# Altium schematic sheet ADS.SchDoc
size A4
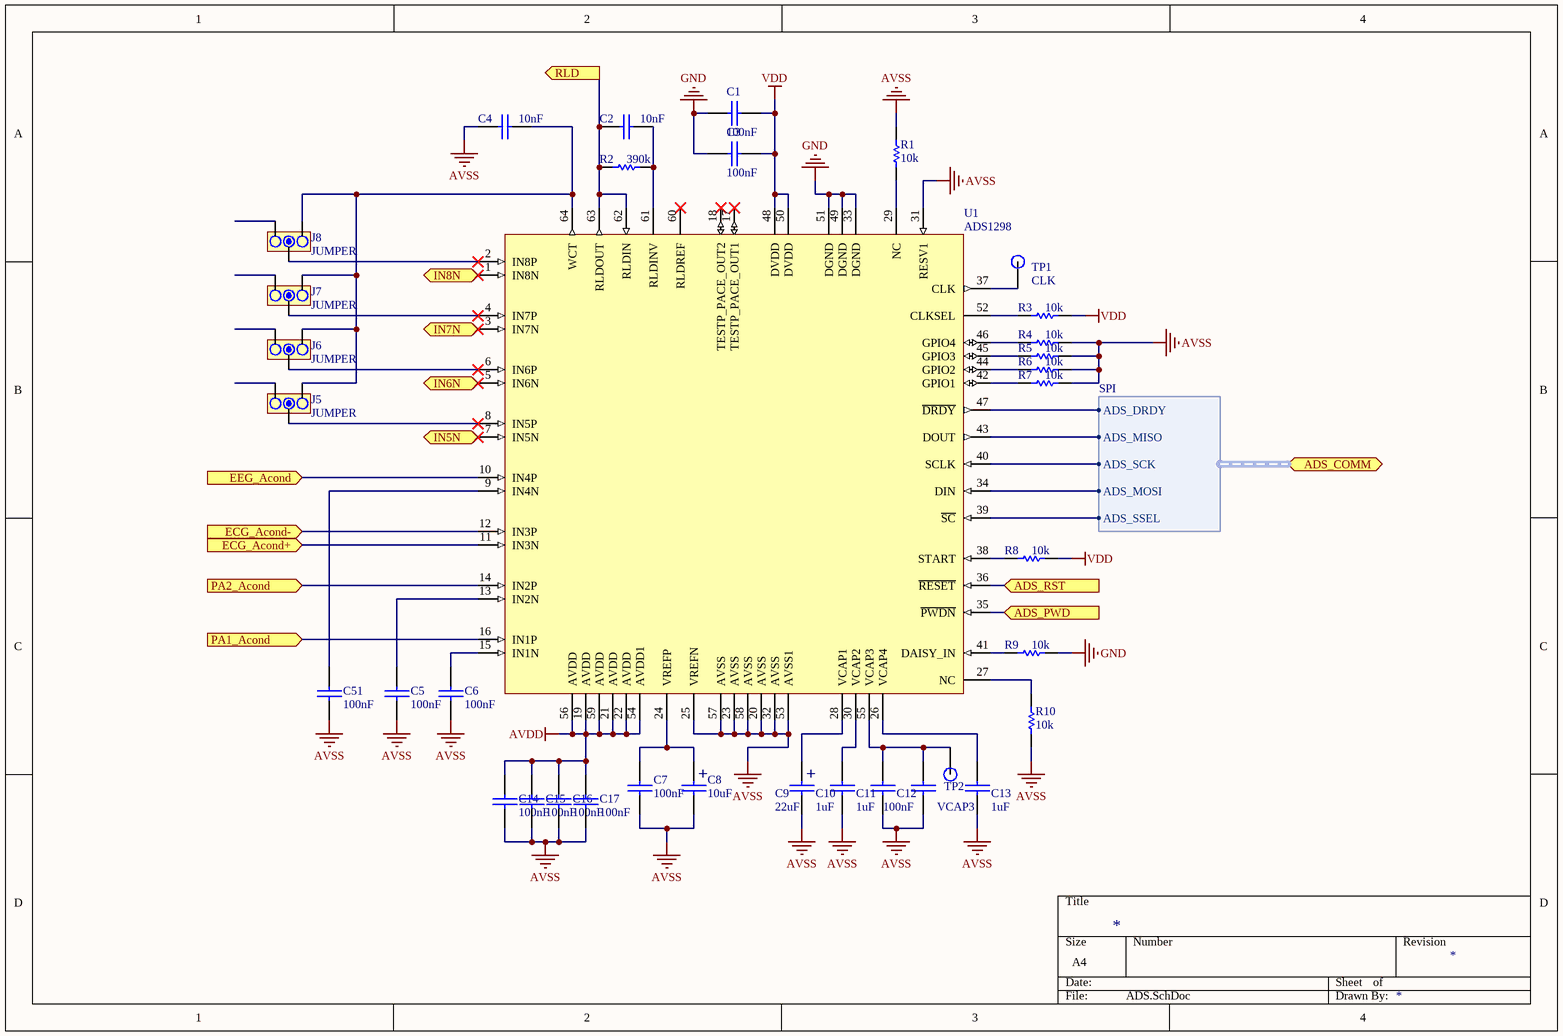
[diagram p0: ADS.SchDoc]

## Parts
C1  value 100nF  [0805]  (hidden comment: Capacitor)
C2  value 10nF  [0805]  (hidden comment: Capacitor)
C3  value 100nF  [0805]  (hidden comment: Capacitor)
C4  value 10nF  [0805]  (hidden comment: Capacitor)
C5  value 100nF  [0805]  (hidden comment: Capacitor)
C6  value 100nF  [0805]  (hidden comment: Capacitor)
C7  value 100nF  [0805]  (hidden comment: Capacitor)
C8  value 10uF  [1211 (3528)]  (hidden comment: CAPPOL)
C9  value 22uF  [1211 (3528)]  (hidden comment: CAPPOL)
C10  value 1uF  [0805]  (hidden comment: Capacitor)
C11  value 1uF  [0805]  (hidden comment: Capacitor)
C12  value 100nF  [0805]  (hidden comment: Capacitor)
C13  value 1uF  [0805]  (hidden comment: Capacitor)
C14  value 100nF  [0805]  (hidden comment: Capacitor)
C15  value 100nF  [0805]  (hidden comment: Capacitor)
C16  value 100nF  [0805]  (hidden comment: Capacitor)
C17  value 100nF  [0805]  (hidden comment: Capacitor)
C51  value 100nF  [0805]  (hidden comment: Capacitor)
J5  JUMPER  [JUMPER3]
J6  JUMPER  [JUMPER3]
J7  JUMPER  [JUMPER3]
J8  JUMPER  [JUMPER3]
R1  value 10k  [0805]  (hidden comment: Resistor)
R2  value 390k  [0805]  (hidden comment: Resistor)
R3  value 10k  [0805]  (hidden comment: Resistor)
R4  value 10k  [0805]  (hidden comment: Resistor)
R5  value 10k  [0805]  (hidden comment: Resistor)
R6  value 10k  [0805]  (hidden comment: Resistor)
R7  value 10k  [0805]  (hidden comment: Resistor)
R8  value 10k  [0805]  (hidden comment: Resistor)
R9  value 10k  [0805]  (hidden comment: Resistor)
R10  value 10k  [0805]  (hidden comment: Resistor)
TP1  CLK  [PAD]
TP2  VCAP3  [PAD]
U1  ADS1298  [PAG64]

## Ports
ADS_COMM (harness SPI), ADS_PWD (in), ADS_RST (in), ECG_Acond+ (in), ECG_Acond- (in), EEG_Acond (in), IN5N (in), IN6N (in), IN7N (in), IN8N (in), PA1_Acond (in), PA2_Acond (in), RLD (out)

## Harnesses
SPI: ADS_DRDY, ADS_MISO, ADS_SCK, ADS_MOSI, ADS_SSEL

## Nets
AVDD: C14.1 C15.1 C16.1 C17.1 U1.19(AVDD) U1.21(AVDD) U1.22(AVDD) U1.54(AVDD1) U1.56(AVDD) U1.59(AVDD)
AVSS: C4.2 C5.1 C6.1 C7.1 C8.2 C9.2 C10.1 C11.1 C12.1 C13.1 C14.2 C15.2 C16.2 C17.2 C51.1 R1.1 R4.2 R5.2 R6.2 R7.2 R10.1 U1.20(AVSS) U1.23(AVSS) U1.25(VREFN) U1.31(RESV1) U1.32(AVSS) U1.53(AVSS1) U1.57(AVSS) U1.58(AVSS)
GND: C1.2 C3.2 R9.2 U1.33(DGND) U1.49(DGND) U1.51(DGND)
VDD: C1.1 C3.1 R3.2 R8.2 U1.48(DVDD) U1.50(DVDD)
ADS_PWD: U1.35(~{PWDN}) ; port ADS_PWD
ADS_RST: U1.36(~{RESET}) ; port ADS_RST
ECG_Acond+: U1.11(IN3N) ; port ECG_Acond+
ECG_Acond-: U1.12(IN3P) ; port ECG_Acond-
EEG_Acond: U1.10(IN4P) ; port EEG_Acond
IN5N: U1.7(IN5N) ; port IN5N
IN6N: U1.5(IN6N) ; port IN6N
IN7N: U1.3(IN7N) ; port IN7N
IN8N: U1.1(IN8N) ; port IN8N
PA1_Acond: U1.16(IN1P) ; port PA1_Acond
PA2_Acond: U1.14(IN2P) ; port PA2_Acond
RLD: C2.2 R2.1 U1.62(RLDIN) U1.63(RLDOUT) ; port RLD
NetC2_1: C2.1 R2.2 U1.61(RLDINV)
NetC4_1: C4.1 J5.3 J6.3 J7.3 J8.3 U1.64(WCT)
NetC5_2: C5.2 U1.13(IN2N)
NetC6_2: C6.2 U1.15(IN1N)
NetC7_2: C7.2 C8.1 U1.24(VREFP)
NetC9_1: C9.1 U1.28(VCAP1)
NetC10_2: C10.2 U1.30(VCAP2)
NetC11_2: C11.2 C12.2 TP2.1 U1.55(VCAP3)
NetC13_2: C13.2 U1.26(VCAP4)
NetC51_2: C51.2 U1.9(IN4N)
NetJ5_2: J5.2 U1.8(IN5P)
NetJ6_2: J6.2 U1.6(IN6P)
NetJ7_2: J7.2 U1.4(IN7P)
NetJ8_2: J8.2 U1.2(IN8P)
NetR1_2: R1.2 U1.29(NC)
NetR3_1: R3.1 U1.52(CLKSEL)
NetR4_1: R4.1 U1.46(GPIO4)
NetR5_1: R5.1 U1.45(GPIO3)
NetR6_1: R6.1 U1.44(GPIO2)
NetR7_1: R7.1 U1.42(GPIO1)
NetR8_1: R8.1 U1.38(START)
NetR9_1: R9.1 U1.41(DAISY_IN)
NetR10_2: R10.2 U1.27(NC)
NetTP1_1: TP1.1 U1.37(CLK)
NetU1_34: U1.34(DIN) ; port ADS_COMM.ADS_MOSI
NetU1_39: U1.39(~{SC}) ; port ADS_COMM.ADS_SSEL
NetU1_40: U1.40(SCLK) ; port ADS_COMM.ADS_SCK
NetU1_43: U1.43(DOUT) ; port ADS_COMM.ADS_MISO
NetU1_47: U1.47(~{DRDY}) ; port ADS_COMM.ADS_DRDY

Not connected (* = marked no-connect by the designer): J5 1; J6 1; J7 1; J8 1; U1 17(TESTP_PACE_OUT1)* 18(TESTP_PACE_OUT2)* 60(RLDREF)*

## Notes on the sheet
- (in symbol CAPPOL) +

## Library data of the parts
C10-C13 = Capacitor: Dielectric: X5R; Voltage: *
J5-J8 = JUMPER3
TP1 TP2 = Test Point
C1-C7 C14-C17 C51 = Capacitor: Dielectric: *; Voltage: *